# Altium schematic sheet supply-protection.SchDoc
size A3; DocumentNumber: 45; SheetNumber: 45; SheetTotal: 45; SheetDescription: Power Supply Protection
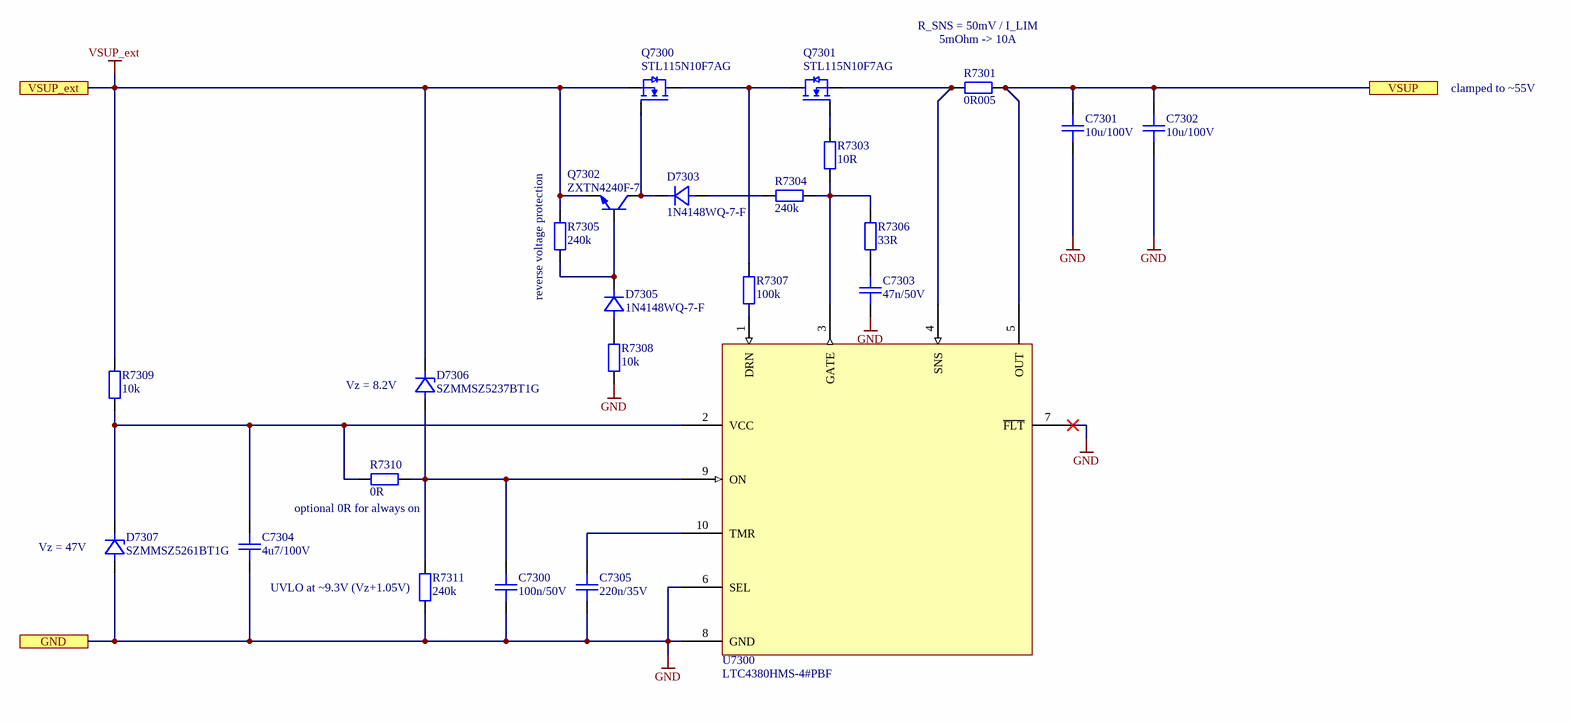
[diagram p0: supply-protection.SchDoc]

## Parts
C7300  100n/50V  [CAPC1005X06N]
C7301  10u/100V  [CAPC5750X28N]
C7302  10u/100V  [CAPC5750X28N]
C7303  47n/50V  [CAPC1005X06N]
C7304  4u7/100V  [CAPC3225X25N]
C7305  220n/35V  [CAPC1005X06N]
D7303  1N4148WQ-7-F  [SOD-123_CASE-425-04-ISSUE-G]
D7305  1N4148WQ-7-F  [SOD-123_CASE-425-04-ISSUE-G]
D7306  SZMMSZ5237BT1G  [SOD-123_CASE-425-04-ISSUE-G]
D7307  SZMMSZ5261BT1G  [SOD-123_CASE-425-04-ISSUE-G]
Q7300  STL115N10F7AG  [ST_PowerFLAT_5x6_WF_type_C]
Q7301  STL115N10F7AG  [ST_PowerFLAT_5x6_WF_type_C]
Q7302  ZXTN4240F-7  [DIODES_SOT23_NPN]
R7301  0R005  [PANASONIC_ERJMS4H]
R7303  10R  [RESC1005X04N]
R7304  240k  [RESC1005X04N]
R7305  240k  [RESC1005X04N]
R7306  33R  [RESC1005X04N]
R7307  100k  [RESC1005X04N]
R7308  10k  [RESC1005X04N]
R7309  10k  [RESC1005X04N]
R7310  0R  [RESC1005X04N]
R7311  240k  [RESC1005X04N]
U7300  LTC4380HMS-4#PBF  [LTC4380-MSOP10]

## Ports
GND, VSUP, VSUP_ext

## Nets
GND: C7300.2 C7301.1 C7302.1 C7303.1 C7304.1 C7305.1 D7307.2(A) R7308.1 R7311.1 U7300.6(SEL) U7300.7(~{FLT}) U7300.8(GND) ; port GND
VSUP_ext: D7306.1(K) Q7300.S Q7302.E R7305.2 R7309.2 ; port VSUP_ext
VSUP: C7301.2 C7302.2 R7301.2 U7300.5(OUT) ; port VSUP
NetC7300_1: C7300.1 D7306.2(A) R7310.1 R7311.2 U7300.9(ON)
NetC7303_2: C7303.2 R7306.1
NetC7304_2: C7304.2 D7307.1(K) R7309.1 R7310.2 U7300.2(VCC)
NetC7305_2: C7305.2 U7300.10(TMR)
NetD7303_1: D7303.1(K) Q7300.G Q7302.C
NetD7303_2: D7303.2(A) R7304.2
NetD7305_1: D7305.1(K) Q7302.B R7305.1
NetD7305_2: D7305.2(A) R7308.2
NetQ7300_D: Q7300.D Q7301.D R7307.2
NetQ7301_G: Q7301.G R7303.2
NetQ7301_S: Q7301.S R7301.1 U7300.4(SNS)
NetR7303_1: R7303.1 R7304.1 R7306.2 U7300.3(GATE)
NetR7307_1: R7307.1 U7300.1(DRN)

## Notes on the sheet
- R_SNS = 50mV / I_LIM
- (near R7301) 5mOhm -> 10A
- clamped to ~55V
- (near R7305) reverse voltage protection
- (near D7306) Vz = 8.2V
- (near R7310) optional 0R for always on
- (near D7307) Vz = 47V
- (near R7311) UVLO at ~9.3V (Vz+1.05V)
- Fraunhofer IISB
- Schottkystr. 10
- developed by:
- 91058 Erlangen
- Germany
- Author
- Project
- License
- Description
- File
- Version
- Release Date
- Sheet
- foxbms.org <https://foxbms.org>
- www.iisb.fraunhofer.de <https://www.iisb.fraunhofer.de/>
- foxBMS Team
- /

## Library data of the parts
C7300 = gen_C_ceramic_100n_50V_X7R_0402: MLCC; Capacitance: 100n; Rated Voltage: 50V; Dielectric: X7R; Case EIA: 0402; Case Metric: 1005; Automotive Qualified: True; PnP Package: 0402C; PnP Value: 100nF/50V/X7R; PnP equipped: x; AEC-Q Norm: AEC-Q200; Part Number: gen_C_ceramic_100n_50V_X7R_0402; Supplier 1: Farnell; Supplier Part Number 1: 2210822; ECCN: EAR99
C7301 C7302 = gen_C_ceramic_10u_100V_X7S_2220: MLCC; Capacitance: 10u; Rated Voltage: 100V; Dielectric: X7S; Case EIA: 2220; Case Metric: 5750; Automotive Qualified: True; AEC-Q Grade: Grade 0; AEC-Q Norm: AEC-Q200; Part Number: gen_C_ceramic_10u_100V_X7S_2220; Supplier 1: Digikey; Supplier Part Number 1: 445-13152-1-ND; ECCN: EAR99
C7303 = gen_C_ceramic_47n_50V_X7R_0402: MLCC; Capacitance: 47n; Rated Voltage: 50V; Dielectric: X7R; Case EIA: 0402; Case Metric: 1005; Automotive Qualified: True; PnP Package: 0402C; Part Number: gen_C_ceramic_47n_50V_X7R_0402; Supplier 1: Farnell; Supplier Part Number 1: 2210827
C7304 = gen_C_ceramic_4u7_100V_X7S_1210: MLCC; Capacitance: 4u7; Rated Voltage: 100V; Dielectric: X7S; Case EIA: 1210; Case Metric: 3225; PnP Package: 1210C; Automotive Qualified: True; Part Number: gen_C_ceramic_4u7_100V_X7S_1210; Supplier 1: Farnell; Supplier Part Number 1: 2211140; Supplier 2: Farnell; Supplier Part Number 2: 2464634
C7305 = gen_C_ceramic_220n_35V_X7R_0402: MLCC; Capacitance: 220n; Rated Voltage: 35V; Dielectric: X7R; Case EIA: 0402; Case Metric: 1005; Automotive Qualified: True; AEC-Q Grade: Grade 1; AEC-Q Norm: AEC-Q200; PnP Package: 0402C; Part Number: gen_C_ceramic_220n_35V_X7R_0402; ECCN: EAR99; Supplier 1: Digikey; Supplier Part Number 1: 445-173767-1-ND
D7303 D7305 = 1N4148WQ-7-F: Diode; Manufacturer: Diodes Inc.; Breakdown Voltage: 100V; Continuous Forward Current: 300mA; PnP Package: SOD123; Automotive Qualified: True; Part Number: 1N4148WQ-7-F; Part Name: 1N4148WQ-7-F; Operating Temperature: -65°C - +150°C; ComponentLink1Description: Datasheet; ComponentLink1URL: https://www.diodes.com/assets/Datasheets/ds30086.pdf; Supplier 1: Digikey; Supplier Part Number 1: 1N4148WQ-7-FDICT-ND
D7306 = SZMMSZ5237BT1G: Zener Diode; Manufacturer: ON Semiconductor; Breakdown Voltage: 8.2V; PnP Package: SOD123; Automotive Qualified: True; Part Number: SZMMSZ5237BT1G; Part Name: SZMMSZ5237BT1G; Operating Temperature: -55°C - +150°C; ComponentLink1Description: Datasheet; ComponentLink1URL: https://www.onsemi.com/pub/Collateral/MMSZ4678T1-D.PDF; Supplier 1: Digikey; Supplier Part Number 1: SZMMSZ5237BT1GOSCT-ND; Supplier 2: Mouser; Supplier Part Number 2: 863-SZMMSZ5237BT1G
D7307 = SZMMSZ5261BT1G: Zener Diode; Manufacturer: ON Semiconductor; Breakdown Voltage: 47V; PnP Package: SOD123; Automotive Qualified: True; Part Number: SZMMSZ5261BT1G; Part Name: SZMMSZ5261BT1G; Operating Temperature: -55°C - +150°C; ComponentLink1Description: Datasheet; ComponentLink1URL: https://www.mouser.de/datasheet/2/308/MMSZ5221BT1-D-85810.pdf; Supplier 1: Digikey; Supplier Part Number 1: SZMMSZ5261BT1GOSCT-ND; Supplier 2: Mouser; Supplier Part Number 2: 863-SZMMSZ5261BT1G
Q7300 Q7301 = STL115N10F7AG: N-Channel MOSFET, 100 V, 107 A, 5 mOhm; Manufacturer: STMicroelectronics; Maximum Drain-Source Voltage: 100V; Maximum Continous Drain Current (25°C): 107A; R_DS(on): 5m; Total Gate Charge: 72.5nC; Automotive Qualified: True; AEC-Q Norm: AEC-Q101; AEC-Q Grade: Grade 0; Part Number: STL115N10F7AG; Part Name: NMOS; Operating Temperature: -55°C - +175°C; ComponentLink1Description: Datasheet; ComponentLink1URL: https://www.mouser.de/datasheet/2/389/dm00333356-1798814.pdf; Supplier 1: Mouser; Supplier Part Number 1: 511-STL115N10F7AG; Supplier 2: Digikey; Supplier Part Number 2: 497-17622-1-ND; ECCN: EAR99
Q7302 = ZXTN4240F-7: Single NPN Transistor; Manufacturer: Diodes Inc.; Maximum Drain-Source Voltage: 40V; Maximum Continous Drain Current (25°C): 2A; Automotive Qualified: True; Part Number: ZXTN4240F-7; Part Name: NPN; Operating Temperature: -55°C - +150°C; ComponentLink1Description: Datasheet; ComponentLink1URL: https://www.diodes.com/assets/Datasheets/ZXTN4240F.pdf; Supplier 1: Digikey; Supplier Part Number 1: ZXTN4240F-7DICT-ND
R7301 = ERJ-MS4HF5M0U: SMD Shunt Resistor 0R005; Tolerance: 1%; Power: 3W; Case EIA: 2512; Automotive Qualified: True; Part Number: ERJ-MS4HF5M0U; Operating Temperature: -65°C - +170°C; Resistance: 0R005; Supplier 1: Digikey; Supplier Part Number 1: P17093CT-ND
R7303 = gen_R_10R_0402: SMD Resistor 10R 0402; Tolerance: 1%; Power: 0.063W; Case EIA: 0402; Case Metric: 1005; Maximum Working Voltage: 50V; PnP Package: 0402R; Automotive Qualified: True; Part Number: gen_R_10R_0402; Operating Temperature: -55°C - +155°C; Resistance: 10R; Series: E24, E96; PnP Value: 10R; Supplier 1: Farnell; Supplier Part Number 1: 2302417
R7304 R7305 R7311 = gen_R_240k_0402: SMD Resistor 240k 0402; Tolerance: 1%; Power: 0.063W; Case EIA: 0402; Case Metric: 1005; Maximum Working Voltage: 50V; PnP Package: 0402R; Automotive Qualified: True; AEC-Q Grade: Grade 0; AEC-Q Norm: AEC-Q200; Part Number: gen_R_240k_0402; Operating Temperature: -55°C - +155°C; Resistance: 240k; Series: E24; PnP Value: 240k; ECCN: EAR99; Supplier 1: Digikey; Supplier Part Number 1: P240KLCT-ND
R7306 = gen_R_33R_0402: SMD Resistor 33R 0402; Tolerance: 1%; Power: 0.063W; Case EIA: 0402; Case Metric: 1005; Maximum Working Voltage: 50V; PnP Package: 0402R; Automotive Qualified: True; AEC-Q Grade: Grade 0; AEC-Q Norm: AEC-Q200; Part Number: gen_R_33R_0402; Operating Temperature: -55°C - +155°C; Resistance: 33R; Series: E24; PnP Value: 33R; ECCN: EAR99; Supplier 1: Digikey; Supplier Part Number 1: A129609CT-ND
R7307 = gen_R_100k_0402: SMD Resistor 100k 0402; Tolerance: 1%; Power: 0.063W; Case EIA: 0402; Case Metric: 1005; Maximum Working Voltage: 50V; PnP Package: 0402R; Automotive Qualified: True; PnP equipped: x; Part Number: gen_R_100k_0402; Operating Temperature: -55°C - +155°C; Resistance: 100k; Series: E24, E96; PnP Value: 100k; Supplier 1: Farnell; Supplier Part Number 1: 2302839
R7308 R7309 = gen_R_10k_0402: SMD Resistor 10k 0402; Tolerance: 1%; Power: 0.063W; Case EIA: 0402; Case Metric: 1005; Maximum Working Voltage: 50V; PnP Package: 0402R; PnP equipped: x; Automotive Qualified: True; AEC-Q Norm: AEC-Q200; Part Number: gen_R_10k_0402; Operating Temperature: -55°C - +155°C; Resistance: 10k; Series: E24, E96; PnP Value: 10k; Supplier 1: Farnell; Supplier Part Number 1: 2059239; ECCN: EAR99
R7310 = gen_R_0R_0402: SMD Resistor 0R 0402; Power: 0.063W; Case EIA: 0402; Case Metric: 1005; Maximum Working Voltage: 50V; PnP Package: 0402R; Automotive Qualified: True; AEC-Q Norm: AEC-Q200; PnP equipped: x; Part Number: gen_R_0R_0402; Operating Temperature: -55°C - +155°C; Resistance: 0R; Series: Jumper; PnP Value: 0R; Supplier 1: Farnell; Supplier Part Number 1: 1469661; Supplier 2: Farnell; Supplier Part Number 2: 2059190; ECCN: EAR99
U7300 = LTC4380HMS-4#PBF: Low Quiescent Current Surge Stopper; Manufacturer: Analog Devices; Automotive Qualified: False; Part Number: LTC4380HMS-4#PBF; Part Name: LTC4380HMS-4#PBF; Operating Temperature: −40°C - +125°C; ComponentLink1Description: Datasheet; ComponentLink1URL: https://www.analog.com/media/en/technical-documentation/data-sheets/LTC4380.pdf; Supplier 1: Digikey; Supplier Part Number 1: LTC4380HMS-4#PBF-ND